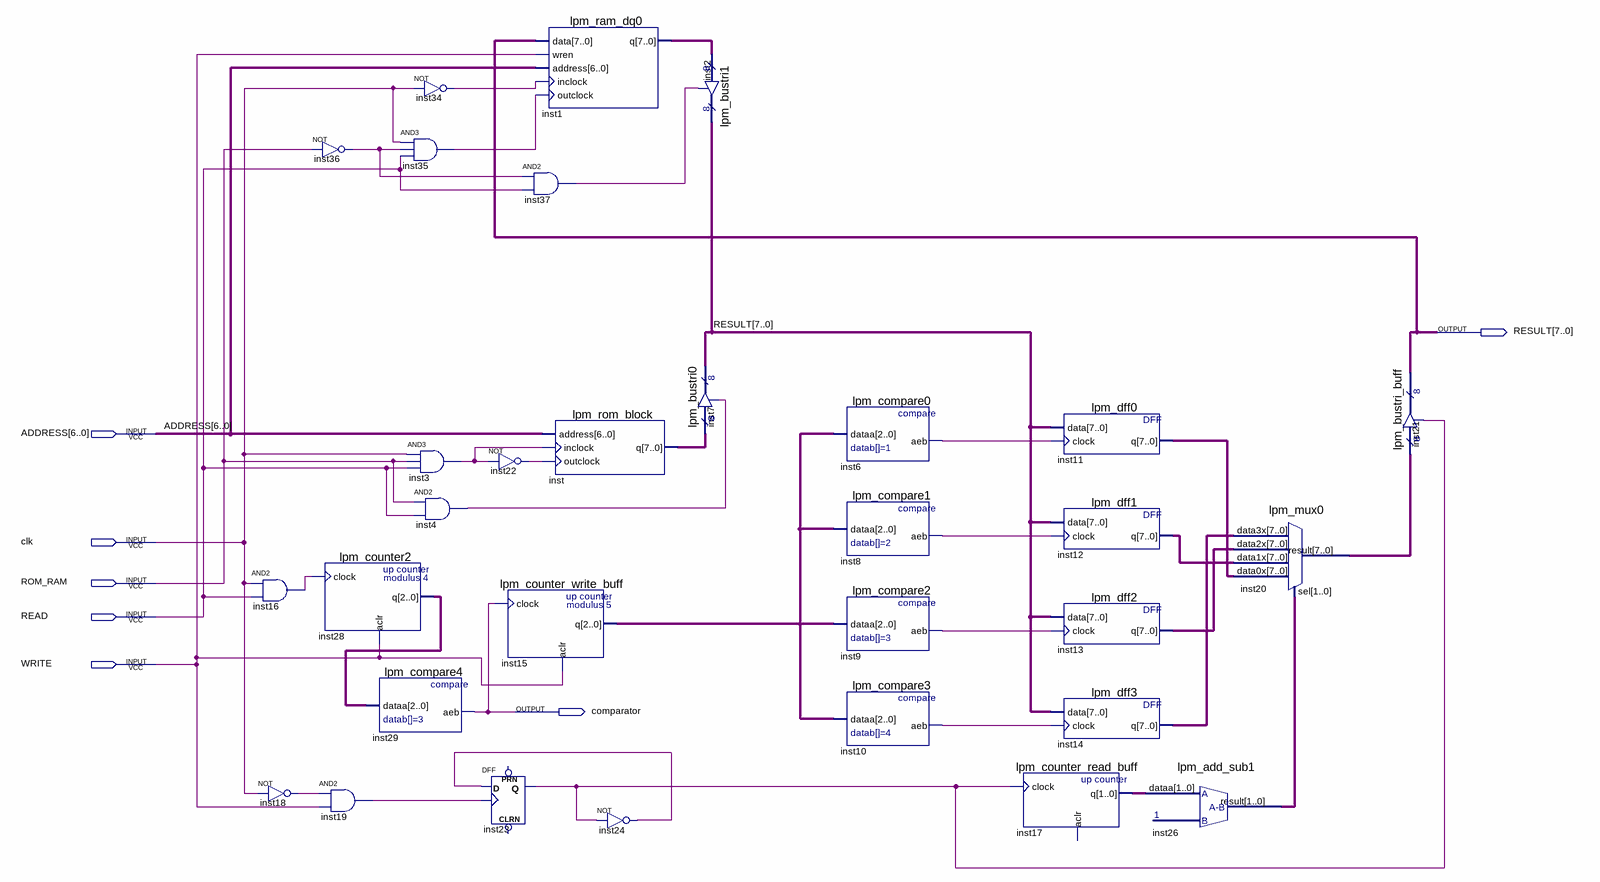
[diagram p0: schematic sheet]
// Quartus schematic SIFO_3_1.bdf as structural Verilog: 31 symbols, 7 pins
module SIFO_3_1 (
  input  [6:0] ADDRESS,
  input  clk,
  input  ROM_RAM,
  input  READ,
  input  WRITE,
  output [7:0] RESULT,
  output comparator
);

  wire inst3_out, inst4_out, inst6_aeb, inst8_aeb, inst9_aeb, inst10_aeb, inst16_out, inst18_out, inst19_out,
       inst22_out, inst23_q, inst24_out, inst34_out, inst35_out, inst36_out, inst37_out;
  wire [1:0] inst17_q, inst26_result;
  wire [2:0] inst15_q, inst28_q;
  wire [7:0] inst1_q, inst11_q, inst12_q, inst13_q, inst14_q, inst20_result, inst_q;

  and inst16 (inst16_out, clk, READ);
  not inst18 (inst18_out, clk);
  not inst36 (inst36_out, ROM_RAM);
  lpm_counter2 inst28 (.clock(inst16_out), .aclr(WRITE), .q(inst28_q));
  and inst19 (inst19_out, inst18_out, WRITE);
  and inst35 (inst35_out, clk, inst36_out, READ);
  lpm_compare4 inst29 (.dataa(inst28_q), .aeb(comparator));
  not inst34 (inst34_out, clk);
  and inst3 (inst3_out, clk, ROM_RAM, READ);
  and inst4 (inst4_out, ROM_RAM, READ);
  not inst22 (inst22_out, inst3_out);
  lpm_counter_write_buff inst15 (.clock(comparator), .aclr(WRITE), .q(inst15_q));
  DFF inst23 (.CLK(inst19_out), .D(inst24_out), .Q(inst23_q));  // open: CLRN, PRN
  lpm_ram_dq0 inst1 (
    .data(RESULT), .wren(WRITE), .address(ADDRESS), .inclock(inst34_out), .outclock(inst35_out), .q(inst1_q));
  and inst37 (inst37_out, inst36_out, READ);
  lpm_rom_block inst (.address(ADDRESS), .inclock(inst3_out), .outclock(inst22_out), .q(inst_q));
  not inst24 (inst24_out, inst23_q);
  lpm_bustri1 inst2 (.enabledt(inst37_out), .data(inst1_q), .tridata(RESULT));
  lpm_bustri0 inst7 (.enabledt(inst4_out), .data(inst_q), .tridata(RESULT));
  lpm_compare0 inst6 (.dataa(inst15_q), .aeb(inst6_aeb));
  lpm_compare1 inst8 (.dataa(inst15_q), .aeb(inst8_aeb));
  lpm_compare2 inst9 (.dataa(inst15_q), .aeb(inst9_aeb));
  lpm_compare3 inst10 (.dataa(inst15_q), .aeb(inst10_aeb));
  lpm_dff0 inst11 (.data(RESULT), .clock(inst6_aeb), .q(inst11_q));
  lpm_dff1 inst12 (.data(RESULT), .clock(inst8_aeb), .q(inst12_q));
  lpm_dff2 inst13 (.data(RESULT), .clock(inst9_aeb), .q(inst13_q));
  lpm_dff3 inst14 (.data(RESULT), .clock(inst10_aeb), .q(inst14_q));
  lpm_counter_read_buff inst17 (.clock(inst23_q), .q(inst17_q));  // open: aclr
  lpm_add_sub1 inst26 (.dataa(inst17_q), .result(inst26_result));
  lpm_mux0 inst20 (
    .data3x(inst14_q), .data2x(inst13_q), .data1x(inst12_q), .data0x(inst11_q), .sel(inst26_result),
    .result(inst20_result));
  lpm_bustri_buff inst21 (.enabledt(inst23_q), .data(inst20_result), .tridata(RESULT));
endmodule
